# EAGLE design schematic (EAGLE 9.1.0)
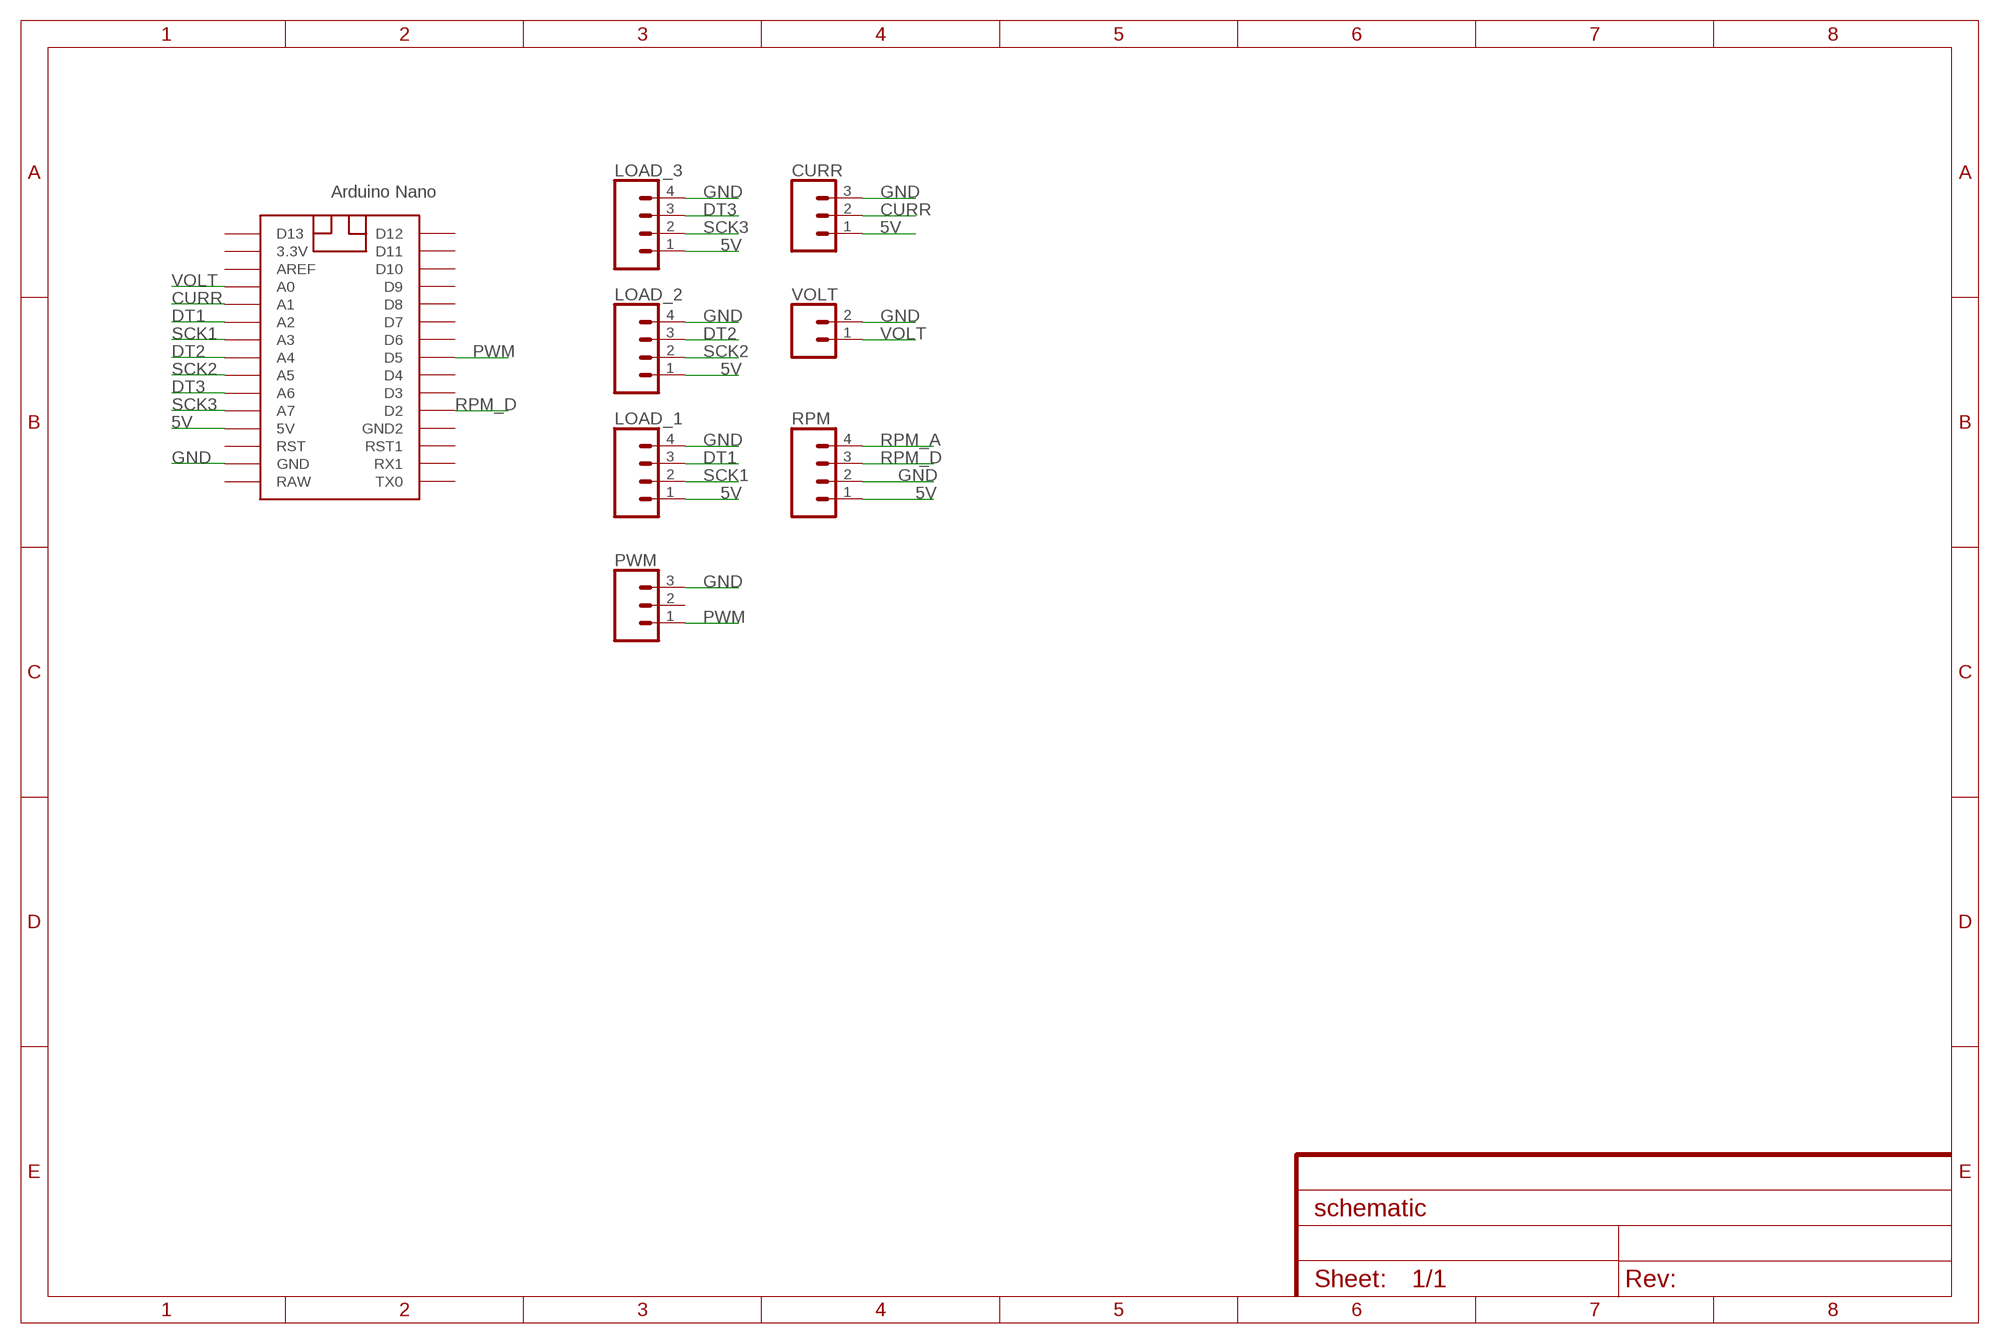
[diagram p0: schematic, sheet 1]

## Parts
CURR  CONN_03POLAR  [MOLEX-1X3]
LOAD_1  CONN_04POLAR  [MOLEX-1X4]
LOAD_2  CONN_04POLAR  [MOLEX-1X4]
LOAD_3  CONN_04POLAR  [MOLEX-1X4]
PWM  CONN_03POLAR  [MOLEX-1X3]
RPM  CONN_04POLAR  [MOLEX-1X4]
U$1  NANO  [NANO]
VOLT  CONN_02POLAR  [MOLEX-1X2]

## Nets
5V: CURR.1 LOAD_1.1 LOAD_2.1 LOAD_3.1 RPM.1 U$1.5V
CURR: CURR.2 U$1.A1
DT1: LOAD_1.3 U$1.A2
DT2: LOAD_2.3 U$1.A4
DT3: LOAD_3.3 U$1.A6
GND: CURR.3 LOAD_1.4 LOAD_2.4 LOAD_3.4 PWM.3 RPM.2 U$1.GND VOLT.2
PWM: PWM.1 U$1.D5
RPM_A: RPM.4
RPM_D: RPM.3 U$1.D2
SCK1: LOAD_1.2 U$1.A3
SCK2: LOAD_2.2 U$1.A5
SCK3: LOAD_3.2 U$1.A7
VOLT: U$1.A0 VOLT.1
Unconnected: PWM.2 U$1.3.3V U$1.AREF U$1.D3 U$1.D4 U$1.D6 U$1.D7 U$1.D8 U$1.D9 U$1.D10 U$1.D11 U$1.D12 U$1.D13 U$1.GND1(GND2) U$1.RAW U$1.RST U$1.RST1 U$1.RX1 U$1.TX0

## Library data of the parts
CURR PWM = SparkFun-Connectors:CONN_03: Multi connection point. Often used as Generic Header-pin footprint for 0.1 inch spaced/style header connections On any of the 0.1 inch spaced packages, you can populate with these: Break Away Headers - Straight <https://www.sparkfun.com/products/116> (PRT-00116) Break Away Male Headers - Right Angle <https://www.sparkfun.com/products/553> (PRT-00553) Female Headers <https://www.sparkfun.com/products/115> (PRT-00115) Break Away Headers - Machine Pin <https://www.sparkfun.com/products/117> (PRT-00117) Break Away Female Headers - Swiss Machine Pin <https://www.sparkfun.com/products/743> (PRT-00743) Stackable Header - 3 Pin (Female, 0.1") <https://www.sparkfun.com/products/13875> (PRT-13875) For SCREWTERMINALS and SPRING TERMINALS visit here: Screw Terimnals on SparkFun.com <https://www.sparkfun.com/search/results?term=Screw+Terminals> (5mm/3.5mm/2.54mm spacing) This device is also useful as a general connection point to wire up your design to another part of your project. Our various solder wires solder well into these plated through hole pads. Hook-Up Wire - Assortment (Stranded, 22 AWG) <https://www.sparkfun.com/products/11375> (PRT-11375) Hook-Up Wire - Assortment (Solid Core, 22 AWG) <https://www.sparkfun.com/products/11367> (PRT-11367) View the entire wire category on our website here <https://www.sparkfun.com/categories/141> Special notes: Molex polarized connector foot print use with SKU : PRT-08232 with associated crimp pins and housings.; PROD_ID: CONN-08625; SF_ID: PRT-08096
LOAD_1-LOAD_3 RPM = SparkFun-Connectors:CONN_04: Multi connection point. Often used as Generic Header-pin footprint for 0.1 inch spaced/style header connections On any of the 0.1 inch spaced packages, you can populate with these: Break Away Headers - Straight <https://www.sparkfun.com/products/116> (PRT-00116) Break Away Male Headers - Right Angle <https://www.sparkfun.com/products/553> (PRT-00553) Female Headers <https://www.sparkfun.com/products/115> (PRT-00115) Break Away Headers - Machine Pin <https://www.sparkfun.com/products/117> (PRT-00117) Break Away Female Headers - Swiss Machine Pin <https://www.sparkfun.com/products/743> (PRT-00743) For SCREWTERMINALS and SPRING TERMINALS visit here: Screw Terimnals on SparkFun.com <https://www.sparkfun.com/search/results?term=Screw+Terminals> (5mm/3.5mm/2.54mm spacing) This device is also useful as a general connection point to wire up your design to another part of your project. Our various solder wires solder well into these plated through hole pads. Hook-Up Wire - Assortment (Stranded, 22 AWG) <https://www.sparkfun.com/products/11375> (PRT-11375) Hook-Up Wire - Assortment (Solid Core, 22 AWG) <https://www.sparkfun.com/products/11367> (PRT-11367) View the entire wire category on our website here <https://www.sparkfun.com/categories/141> Special notes: Molex polarized connector foot print use with SKU : PRT-08231 with associated crimp pins and housings. 1MM SMD Version SKU: PRT-10208; PROD_ID: CONN-08186; SF_ID: PRT-08231
U$1 = Arduino-clone:NANO: Arduino Nano
VOLT = SparkFun-Connectors:CONN_02: Multi connection point. Often used as Generic Header-pin footprint for 0.1 inch spaced/style header connections On any of the 0.1 inch spaced packages, you can populate with these: Break Away Headers - Straight <https://www.sparkfun.com/products/116> (PRT-00116) Break Away Male Headers - Right Angle <https://www.sparkfun.com/products/553> (PRT-00553) Female Headers <https://www.sparkfun.com/products/115> (PRT-00115) Break Away Headers - Machine Pin <https://www.sparkfun.com/products/117> (PRT-00117) Break Away Female Headers - Swiss Machine Pin <https://www.sparkfun.com/products/743> (PRT-00743) For SCREWTERMINALS and SPRING TERMINALS visit here: Screw Terimnals on SparkFun.com <https://www.sparkfun.com/search/results?term=Screw+Terminals> (5mm/3.5mm/2.54mm spacing) This device is also useful as a general connection point to wire up your design to another part of your project. Our various solder wires solder well into these plated through hole pads. Hook-Up Wire - Assortment (Stranded, 22 AWG) <https://www.sparkfun.com/products/11375> (PRT-11375) Hook-Up Wire - Assortment (Solid Core, 22 AWG) <https://www.sparkfun.com/products/11367> (PRT-11367) View the entire wire category on our website here <https://www.sparkfun.com/categories/141> Special notes: Molex polarized connector foot print use with: PRT-08233 with associated crimp pins and housings. 2.54_SCREWTERM for use with PRT-10571. 3.5mm Screw Terminal footprints for PRT-08084 5mm Screw Terminal footprints for use with PRT-08432; SF_ID: PRT-09918

## Board
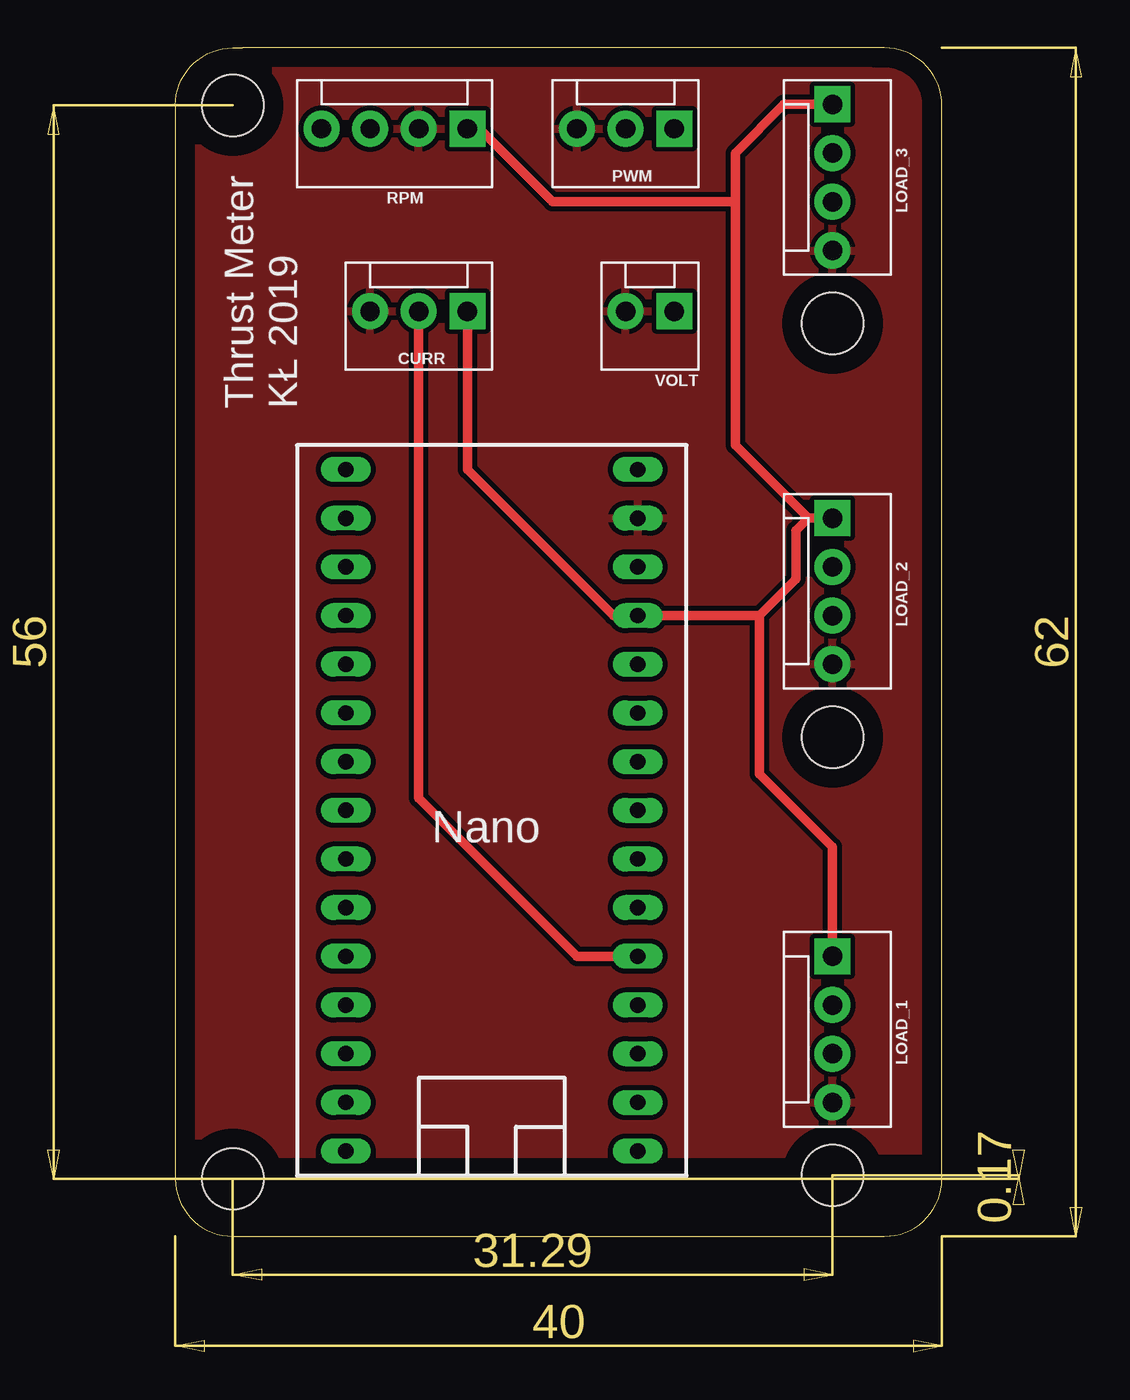
[diagram p1: board, top side]
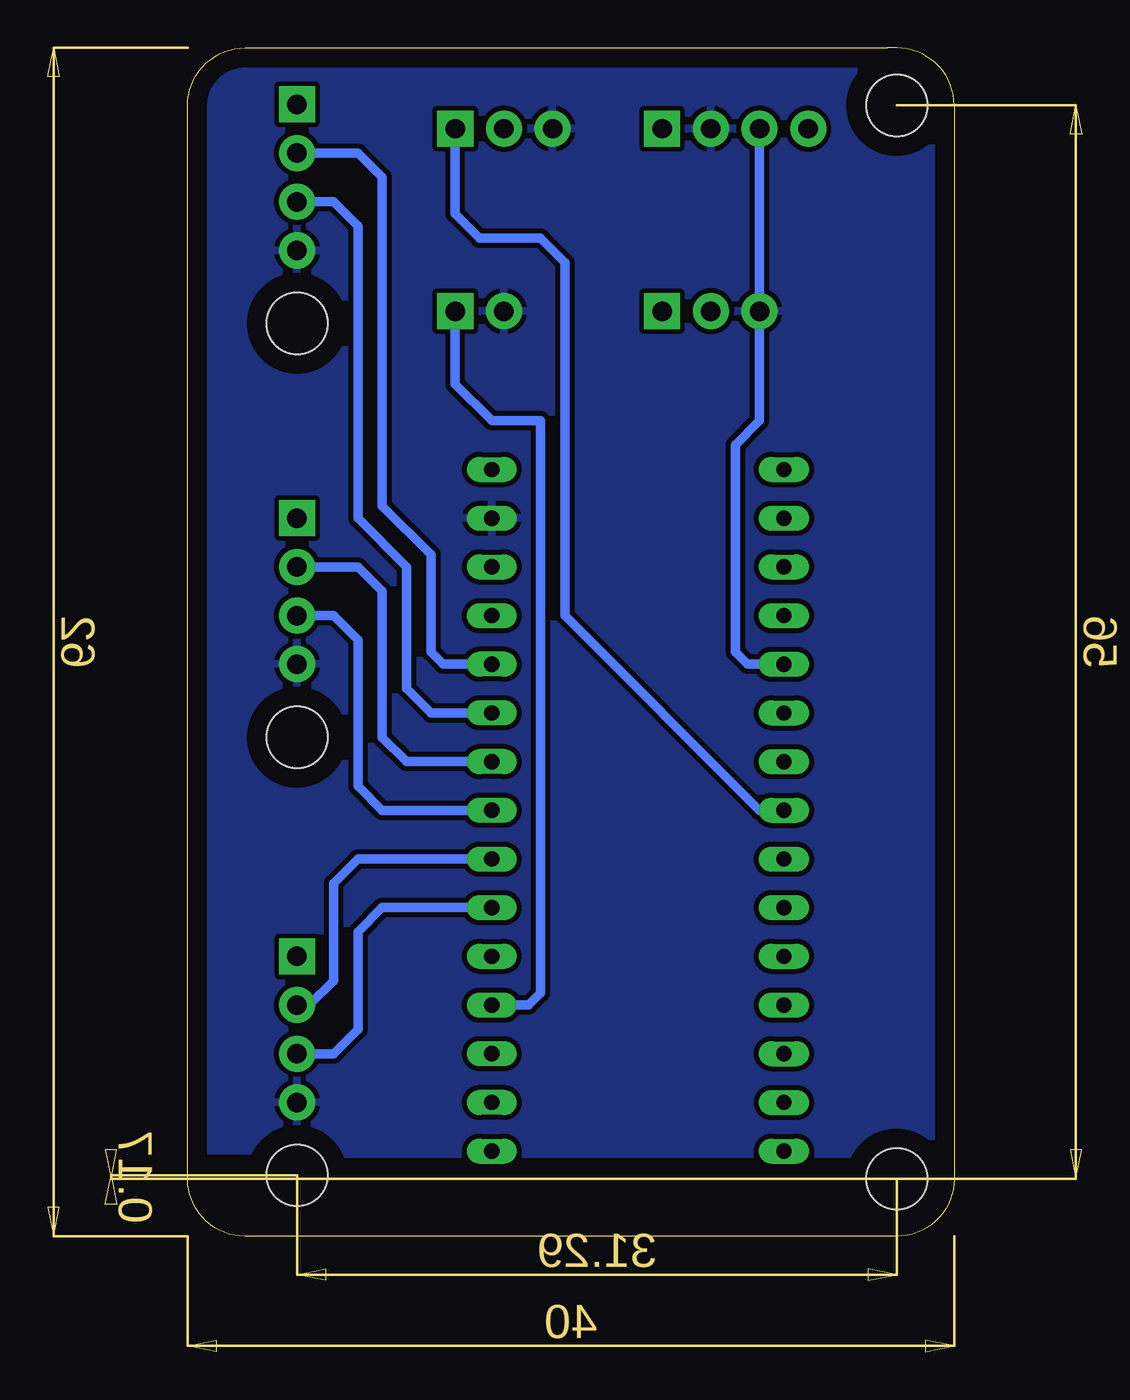
[diagram p2: board, bottom side, seen from below]

Size 40 x 62 mm. Coordinates in mm from the lower left corner, seen from the top.
Outline: 3.5,0 37,0 arc90 40,3 40,3.5 40,59 arc90 37,62 36.5,62 3.5,62 3,62 arc90 0,59 0,3 arc90 3,0 3.5,0
Copper layers (1*16): Top 0.035mm / dielectric 1.5mm / Bottom 0.035mm
Design rules "default": minimum track width 6mil, minimum drill 0.35mm, track to track 6mil, track to pad 6mil, pad to pad 6mil, via to via 6mil, smd to smd 6mil, copper to edge 40mil, drill to drill 6mil, minimum pad ring 10mil, minimum via ring 8mil, stop-mask expansion 4mil, vias tented up to drill 0mil, thermal gap 10mil
Holes 3.2 mm at 3,3 34.29,3.17 3,59 34.29,47.62 34.29,26.04

### Footprints (pad centres in the part's own frame; a part is rotated, then mirrored left to right if it is on the bottom)
MOLEX-1X3 = drill 1.016 pad 1.88 square: 1 0,0 | drill 1.016 pad 1.88: 2 2.54,0; 3 5.08,0
MOLEX-1X4 = drill 1.016 pad 1.88 square: 1 0,0 | drill 1.016 pad 1.88: 2 2.54,0; 3 5.08,0; 4 7.62,0
NANO = drill 0.8 long: 3.3V -7.62,15.24; 5V -7.62,-10.16; A0 -7.62,10.16; A1 -7.62,7.62; A2 -7.62,5.08; A3 -7.62,2.54; A4 -7.62,0; A5 -7.62,-2.54; A6 -7.62,-5.08; A7 -7.62,-7.62; AREF -7.62,12.7; D2 7.62,-7.62; D3 7.62,-5.08; D4 7.62,-2.54; D5 7.62,0; D6 7.62,2.54; D7 7.62,5.08; D8 7.62,7.62; D9 7.62,10.16; D10 7.62,12.7; D11 7.62,15.24; D12 7.62,17.78; D13 -7.62,17.78; GND -7.62,-15.24; GND1 7.62,-10.16; RAW -7.62,-17.78; RST -7.62,-12.7; RST1 7.62,-12.7; RX1 7.62,-15.24; TX0 7.62,-17.78
MOLEX-1X2 = drill 1.016 pad 1.88 square: 1 0,0 | drill 1.016 pad 1.88: 2 2.54,0

### Placement (x,y rotation side)
CURR  15.24,48.26 180 top
LOAD_1  34.29,14.61 270 top
LOAD_2  34.29,37.47 270 top
LOAD_3  34.29,59.05 270 top
PWM  26.04,57.78 180 top
RPM  15.24,57.78 180 top
U$1  16.51,22.23 180 top
VOLT  26.04,48.26 180 top

### Tracks (layer width: path | path; a pad name or v marks a point on that pad's centre or on a via)
5V
  Top 0.508: 30.48,32.38 U$1.5V 22.86,32.38 15.24,40.01 CURR.1 | 30.48,32.38 32.38,34.29 32.38,36.83 33.02,37.47 | LOAD_1.1 34.29,20.32 30.48,24.13 30.48,32.38 | LOAD_2.1 33.02,37.47 | 33.02,37.47 29.21,41.27 29.21,53.98 | 29.21,53.98 29.21,56.52 31.75,59.05 LOAD_3.1 | RPM.1 15.88,57.78 19.68,53.98 29.21,53.98
CURR
  Top 0.508: U$1.A1 20.95,14.61 12.7,22.86 CURR.2
DT1
  Bottom 0.508: U$1.A2 29.84,17.14 31.11,15.88 31.11,10.79 32.38,9.53 LOAD_1.3
DT2
  Bottom 0.508: U$1.A4 29.84,22.23 31.11,23.5 31.11,31.11 32.38,32.38 LOAD_2.3
DT3
  Bottom 0.508: U$1.A6 27.3,27.3 28.57,28.57 28.57,34.92 31.11,37.47 31.11,52.7 32.38,53.98 LOAD_3.3
GND
  pour Top (isolate 0.254): -1.27,-1.27 41.27,-1.27 41.27,63.5 -1.27,63.5
  pour Bottom (isolate 0.254): -1.27,-1.27 -1.27,63.5 41.27,63.5 41.27,-1.27
PWM
  Bottom 0.508: PWM.1 26.04,53.34 24.77,52.07 21.59,52.07 20.32,50.8 20.32,32.38 10.16,22.23 U$1.D5
RPM_D
  Bottom 0.508: RPM.3 10.16,42.55 11.43,41.27 11.43,30.48 10.79,29.84 U$1.D2
SCK1
  Bottom 0.508: U$1.A3 31.11,19.68 32.38,18.41 32.38,13.34 33.66,12.06 LOAD_1.2
SCK2
  Bottom 0.508: U$1.A5 28.57,24.77 29.84,26.04 29.84,33.66 31.11,34.92 LOAD_2.2
SCK3
  Bottom 0.508: LOAD_3.2 31.11,56.52 29.84,55.24 29.84,38.1 27.3,35.56 27.3,30.48 26.67,29.84 U$1.A7
VOLT
  Bottom 0.508: VOLT.1 26.04,44.45 24.13,42.55 21.59,42.55 21.59,12.7 22.23,12.06 U$1.A0

### Text on the board
tPlace: Thrust Meter / KŁ 2019